# Altium project ZD-STM32-ZOUYU.PrjPcb
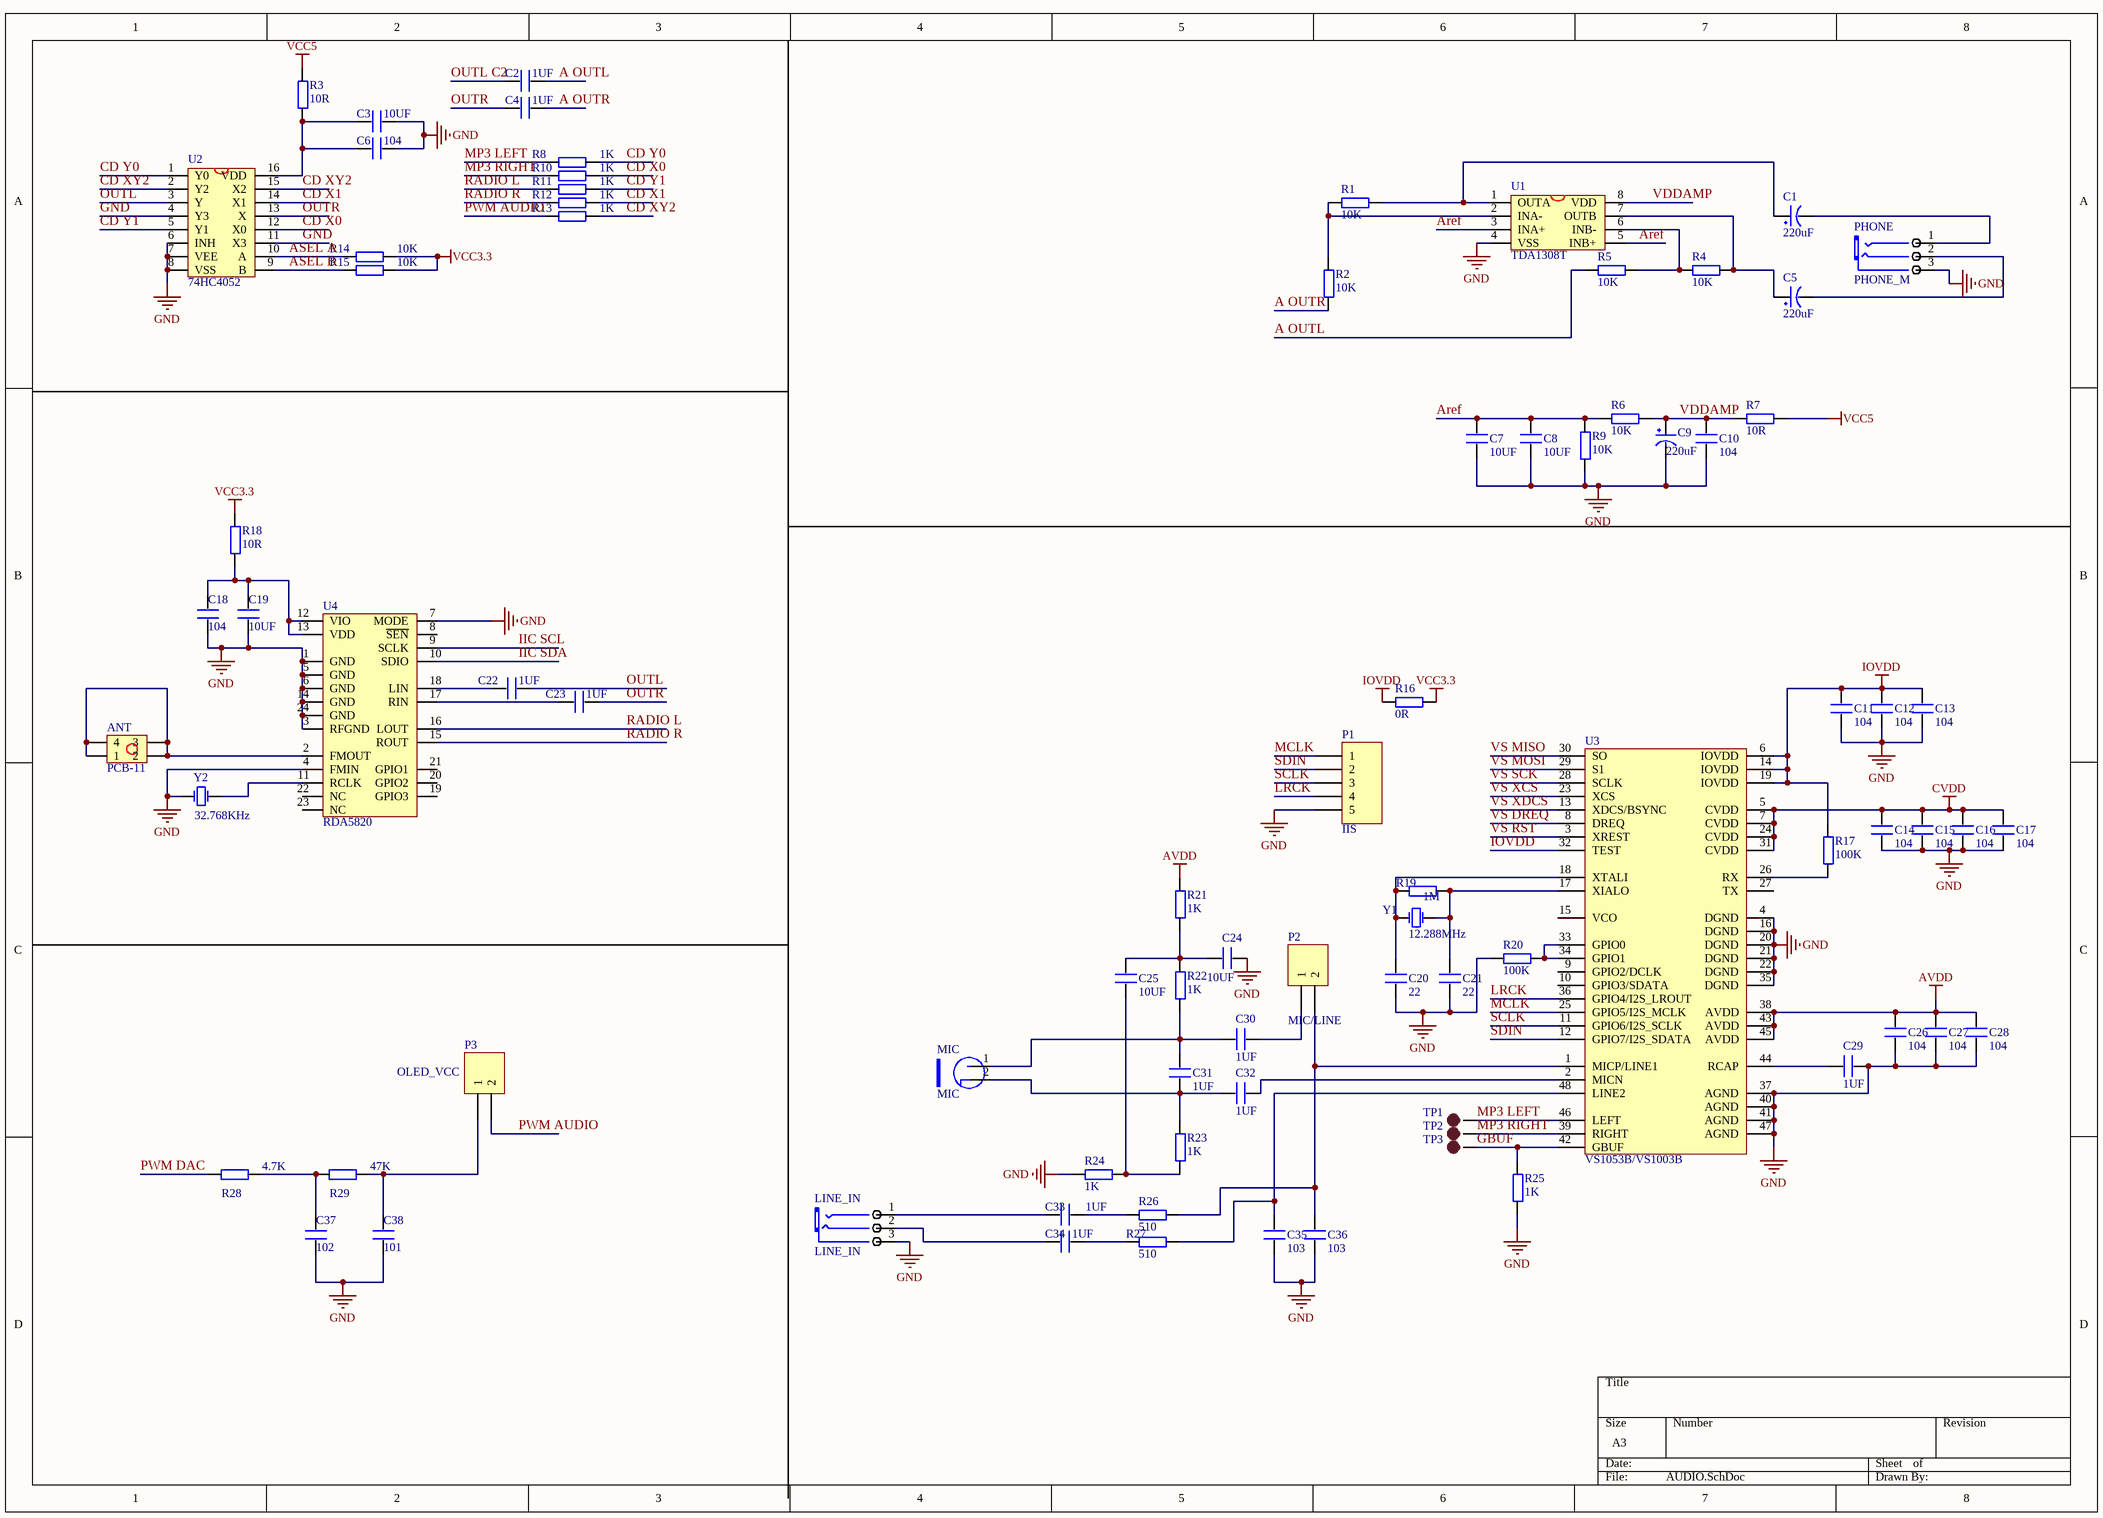
[diagram p0: AUDIO.SchDoc]
4 sheets, 254 parts. Net scope: global (net labels, ports and power ports of the same name join across sheets).
Board files: ZD-STM32-ZOUYU(remove layoout).PcbDoc, ZD-STM32-ZOUYU.PcbDoc
Sheets:
  AUDIO.SchDoc
  DEVICE.SchDoc
  ZD-STM32.SchDoc
  POWER&USB.SchDoc

## Sheet AUDIO.SchDoc
size A3

### Parts
ANT  PCB-11  [PCB-11]
C1  220uF  [CC6.56.5]
C2  1UF  [0603P]
C3  10UF  [0603P]
C4  1UF  [0603P]
C5  220uF  [CC6.56.5]
C6  104  [0603P]
C7  10UF  [0603P]
C8  10UF  [0603P]
C9  220uF  [CC6.56.5]
C10  104  [0603P]
C11  104  [0603P]
C12  104  [0603P]
C13  104  [0603P]
C14  104  [0603P]
C15  104  [0603P]
C16  104  [0603P]
C17  104  [0603P]
C18  104  [0603P]
C19  10UF  [0603P]
C20  22  [0603P]
C21  22  [0603P]
C22  1UF  [0603P]
C23  1UF  [0603P]
C24  10UF  [0603P]
C25  10UF  [0603P]
C26  104  [0603P]
C27  104  [0603P]
C28  104  [0603P]
C29  1UF  [0603P]
C30  1UF  [0603P]
C31  1UF  [0603P]
C32  1UF  [0603P]
C33  1UF  [0603P]
C34  1UF  [0603P]
C35  103  [0603P]
C36  103  [0603P]
C37  102  [0603P]
C38  101  [0603P]
LINE_IN  LINE_IN  [PHONE_ST]
MIC  MIC  [MIC]
P1  IIS  [HDR1X5]
P2  MIC/LINE  [HDR1X2]
P3  OLED_VCC  [HDR1X2]
PHONE  PHONE_M  [PHONE_ST]
R1  10K  [0603P]
R2  10K  [0603P]
R3  10R  [0603P]
R4  10K  [0603P]
R5  10K  [0603P]
R6  10K  [0603P]
R7  10R  [0603P]
R8  1K  [0603P]
R9  10K  [0603P]
R10  1K  [0603P]
R11  1K  [0603P]
R12  1K  [0603P]
R13  1K  [0603P]
R14  10K  [0603P]
R15  10K  [0603P]
R16  0R  [0603P]
R17  100K  [0603P]
R18  10R  [0603P]
R19  1M  [0603P]
R20  100K  [0603P]
R21  1K  [0603P]
R22  1K  [0603P]
R23  1K  [0603P]
R24  1K  [0603P]
R25  1K  [0603P]
R26  510  [0603P]
R27  510  [0603P]
R28  4.7K  [0603P]
R29  47K  [0603P]
TP1  TEST POINT  [TP-1.5]  (value not drawn)
TP2  TEST POINT  [TP-1.5]  (value not drawn)
TP3  TEST POINT  [TP-1.5]  (value not drawn)
U1  TDA1308T  [SOP-8]
U2  74HC4052  [SOP16M]
U3  VS1053B/VS1003B  [mTQFP48]
U4  RDA5820  [QFN24]
Y1  12.288MHz  [XTAL_US]
Y2  32.768KHz  [XTAL32]

### Nets
AVDD: C26.2 C27.2 C28.2 R21.2 U3.38(AVDD) U3.43(AVDD) U3.45(AVDD)
CVDD: C14.2 C15.2 C16.2 C17.2 U3.5(CVDD) U3.7(CVDD) U3.24(CVDD) U3.31(CVDD)
GND: C3.2 C6.2 C7.1 C8.1 C9.2(GND) C10.1 C11.1 C12.1 C13.1 C14.1 C15.1 C16.1 C17.1 C18.1 C19.1 C20.1 C21.1 C24.1 C26.1 C27.1 C28.1 C29.2 C35.1 C36.1 C37.1 C38.1 LINE_IN.3(COM) P1.5 PHONE.3(COM) R9.1 R20.1 R24.1 R25.1 U1.4(VSS) U2.4(Y3) U2.6(INH) U2.7(VEE) U2.8(VSS) U2.11(X3) U3.4(DGND) U3.16(DGND) U3.20(DGND) U3.21(DGND) U3.22(DGND) U3.35(DGND) U3.37(AGND) U3.40(AGND) U3.41(AGND) U3.47(AGND) U4.1(GND) U4.3(RFGND) U4.4(FMIN) U4.5(GND) U4.6(GND) U4.7(MODE) U4.14(GND) U4.24(GND) Y2.1(OSC1)
IOVDD: C11.2 C12.2 C13.2 R16.1 R17.2 U3.6(IOVDD) U3.14(IOVDD) U3.19(IOVDD) U3.32(TEST)
VCC3.3: R14.2 R15.2 R16.2 R18.2
VCC5: R3.2 R7.2
A OUTL: C2.2 R5.1
A OUTR: C4.2 R2.1
Aref: C7.2 C8.2 R6.1 R9.2 U1.3(INA+) U1.5(INB+)
ASEL A: R14.1 U2.10(A)
ASEL B: R15.1 U2.9(B)
CD X0: R10.2 U2.12(X0)
CD X1: R12.2 U2.14(X1)
CD XY2: R13.2 U2.2(Y2) U2.15(X2)
CD Y0: R8.2 U2.1(Y0)
CD Y1: R11.2 U2.5(Y1)
GBUF: R25.2 TP3.1 U3.42(GBUF)
IIC SCL: U4.9(SCLK)
IIC SDA: U4.10(SDIO)
LRCK: P1.4 U3.36(GPIO4/I2S_LROUT)
MCLK: P1.1 U3.25(GPIO5/I2S_MCLK)
MP3 LEFT: R8.1 TP1.1 U3.46(LEFT)
MP3 RIGHT: R10.1 TP2.1 U3.39(RIGHT)
OUTL: C22.1 U2.3(Y)
OUTL C2: C2.1
OUTR: C4.1 C23.1 U2.13(X)  [also labelled OUTR ]
PWM AUDIO: P3.2 R13.1
PWM DAC: R28.1  [project net PB6]
RADIO L: R11.1 U4.16(LOUT)
RADIO R: R12.1 U4.15(ROUT)
SCLK: P1.3 U3.11(GPIO6/I2S_SCLK)
SDIN: P1.2 U3.12(GPIO7/I2S_SDATA)
VDDAMP: C9.1(VCC) C10.2 R6.2 R7.1 U1.8(VDD)
VS DREQ: U3.8(DREQ)  [project net PC13]
VS MISO: U3.30(SO)  [project net PA6]
VS MOSI: U3.29(S1)  [project net PA7]
VS RST: U3.3(XREST)  [project net PE6]
VS SCK: U3.28(SCLK)  [project net PA5]
VS XCS: U3.23(XCS)
VS XDCS: U3.13(XDCS/BSYNC)
NetANT_1: ANT.1 ANT.2 ANT.3 ANT.4 U4.2(FMOUT)
NetC1_1: C1.1(VCC) R1.2 U1.1(OUTA)
NetC1_2: C1.2(GND) PHONE.1(CHL)
NetC3_1: C3.1 C6.1 R3.1 U2.16(VDD)
NetC5_1: C5.1(VCC) R4.2 U1.7(OUTB)
NetC5_2: C5.2(GND) PHONE.2(CHR)
NetC18_2: C18.2 C19.2 R18.1 U4.12(VIO) U4.13(VDD)
NetC20_2: C20.2 R19.1 U3.18(XTALI) Y1.1(OSC1)
NetC21_2: C21.2 R19.2 U3.17(XIALO) Y1.2(OSC2)
NetC22_2: C22.2 U4.18(LIN)
NetC23_2: C23.2 U4.17(RIN)
NetC24_2: C24.2 C25.2 R21.1 R22.2
NetC25_1: C25.1 R23.1 R24.2
NetC29_1: C29.1 U3.44(RCAP)
NetC30_1: C30.1 C31.2 MIC.1(VCC) R22.1
NetC30_2: C30.2 P2.1
NetC31_1: C31.1 C32.1 MIC.2(GND) R23.2
NetC32_2: C32.2 U3.2(MICN)
NetC33_1: C33.1 LINE_IN.1(CHL)
NetC33_2: C33.2 R26.1
NetC34_1: C34.1 LINE_IN.2(CHR)
NetC34_2: C34.2 R27.1
NetC35_2: C35.2 R27.2 U3.48(LINE2)
NetC36_2: C36.2 P2.2 R26.2 U3.1(MICP/LINE1)
NetC37_2: C37.2 R28.2 R29.1
NetC38_2: C38.2 P3.1 R29.2
NetR1_1: R1.1 R2.2 U1.2(INA-)
NetR4_1: R4.1 R5.2 U1.6(INB-)
NetR17_1: R17.1 U3.26(RX)
NetR20_2: R20.2 U3.33(GPIO0) U3.34(GPIO1)
NetU4_11: U4.11(RCLK) Y2.2(OSC2)

Not connected (* = marked no-connect by the designer): U3 9(GPIO2/DCLK) 10(GPIO3/SDATA) 15(VCO) 27(TX); U4 8(~{SEN}) 19(GPIO3) 20(GPIO2) 21(GPIO1) 22(NC) 23(NC)

### Library data of the parts
ANT = PCB-11: PCB接线端子
C1 C5 C9 = CAP
C2-C4 C6-C8 C10-C38 = C
LINE_IN = PHONE_M
P1 = Header 5: Header, 5-Pin; LatestRevisionDate: 17-Jul-2002; LatestRevisionNote: Re-released for DXP Platform.; Publisher: Altium Limited
P2 P3 = Header 2: Header, 2-Pin; LatestRevisionDate: 17-Jul-2002; LatestRevisionNote: Re-released for DXP Platform.; Publisher: Altium Limited
R1-R29 = R
TP1-TP3 = TEST-POINT: 测试点
U1 = TDA1308
U2 = CD4052
U3 = VS1053
Y1 = XTAL_2: Crystal Oscillator; Published: 8-Jun-2000; LatestRevisionDate: 17-Jul-2002; LatestRevisionNote: Re-released for DXP Platform.; Publisher: Altium Limited
Y2 = XTAL_3: 32.768K; Published: 8-Jun-2000; LatestRevisionDate: 17-Jul-2002; LatestRevisionNote: Re-released for DXP Platform.; Publisher: Altium Limited

## Sheet DEVICE.SchDoc
size A3
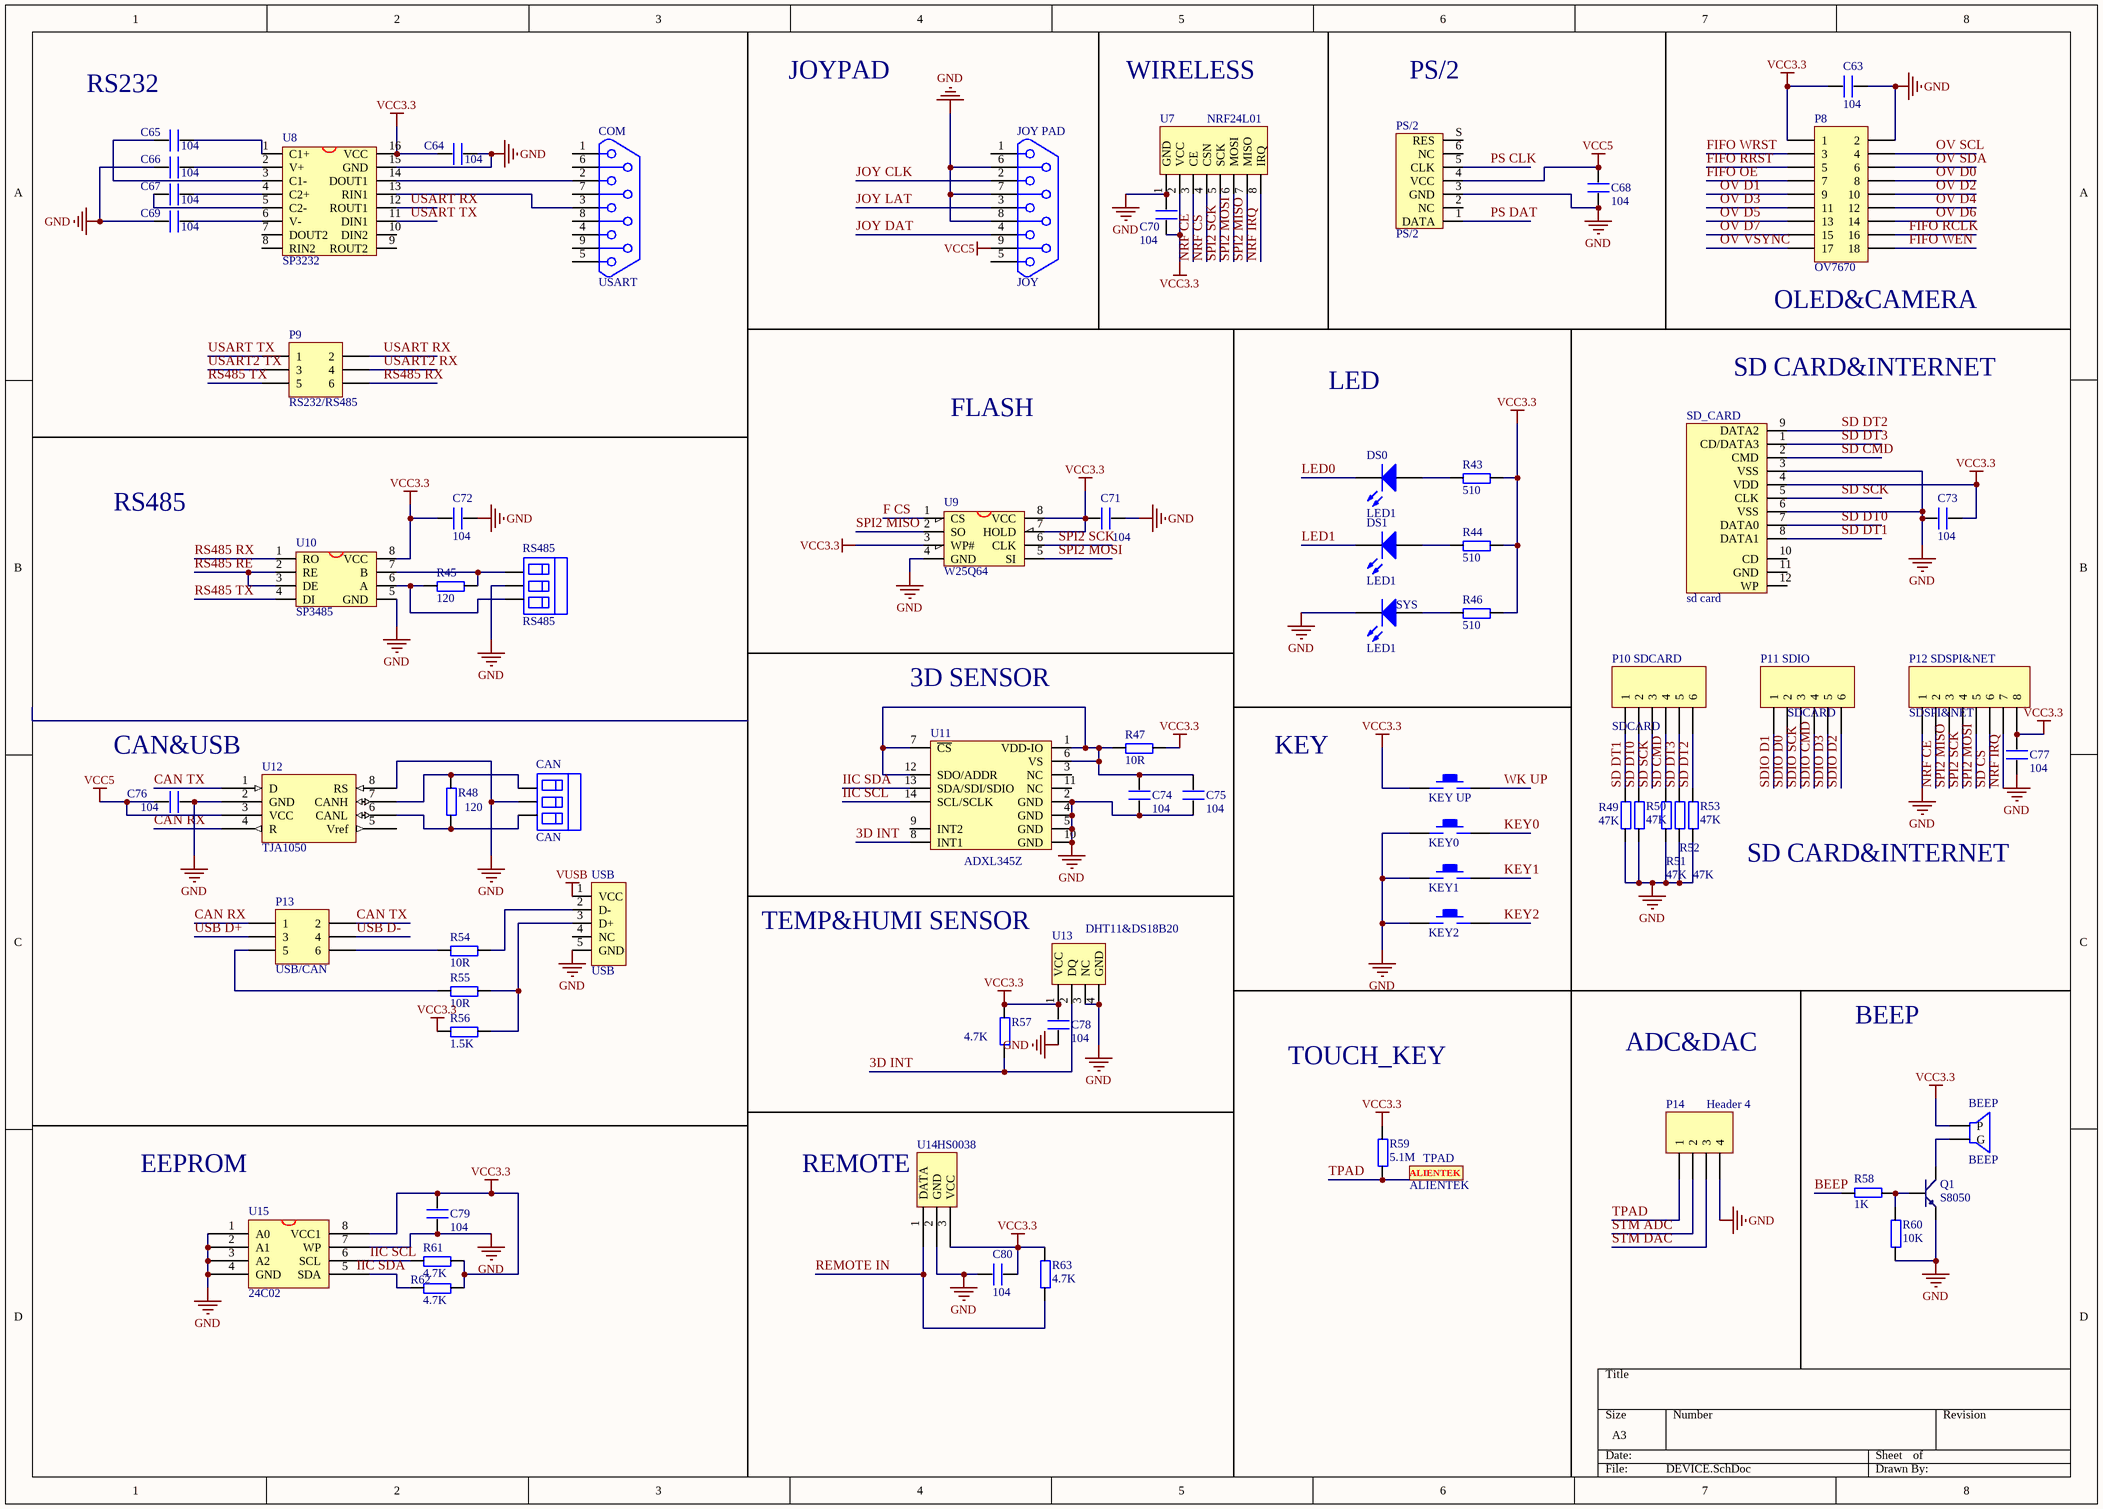
[diagram p1: DEVICE.SchDoc]

### Parts
BEEP  BEEP  [BELL-5]
C63  104  [0603P]
C64  104  [0603P]
C65  104  [0603P]
C66  104  [0603P]
C67  104  [0603P]
C68  104  [0603P]
C69  104  [0603P]
C70  104  [0603P]
C71  104  [0603P]
C72  104  [0603P]
C73  104  [0603P]
C74  104  [0603P]
C75  104  [0603P]
C76  104  [0603P]
C77  104  [0603P]
C78  104  [0603P]
C79  104  [0603P]
C80  104  [0603P]
CAN  CAN  [MKDSN_3RMI]
COM  USART  [DB9]
DS0  LED1  [SMDLED]
DS1  LED1  [SMDLED]
JOY_PAD  JOY  [DB9]
KEY0  KEY_M  [KEY_M]  (value not drawn)
KEY1  KEY_M  [KEY_M]  (value not drawn)
KEY2  KEY_M  [KEY_M]  (value not drawn)
KEY_UP  KEY_M  [KEY_M]  (value not drawn)
P8  OV7670  [HDR2X9]
P9  RS232/RS485  [HDR2X3]
P10_SDCARD  SDCARD  [HDR1X6]
P11_SDIO  SDCARD  [HDR1X6]
P12_SDSPI&NET  SDSPI&NET  [HDR1X8]
P13  USB/CAN  [HDR2X3]
P14  Header 4  [HDR1X4]
PS/2  PS/2  [PS2-6PIN]
Q1  S8050  [SOT-23R]
R43  510  [0603P]
R44  510  [0603P]
R45  120  [0603P]
R46  510  [0603P]
R47  10R  [0603P]
R48  120  [0603P]
R49  47K  [0603P]
R50  47K  [0603P]
R51  47K  [0603P]
R52  47K  [0603P]
R53  47K  [0603P]
R54  10R  [0603P]
R55  10R  [0603P]
R56  1.5K  [0603P]
R57  4.7K  [0603P]
R58  1K  [0603P]
R59  5.1M  [0603P]
R60  10K  [0603P]
R61  4.7K  [0603P]
R62  4.7K  [0603P]
R63  4.7K  [0603P]
RS485  RS485  [MKDSN_3RMI]
SD_CARD  sd card  [SDCARD_L]
SYS  LED1  [SMDLED]
TPAD  ALIENTEK  [ALIENTEK_PAD]
U7  NRF24L01  [NRF24L01]
U8  SP3232  [SOP16M]
U9  W25Q64  [SOIC-8]
U10  SP3485  [SOP-8]
U11  ADXL345Z  [LGA14]
U12  TJA1050  [SOP-8]
U13  DHT11&DS18B20  [DHT11]
U14  HS0038  [HS0038]
U15  24C02  [SOP-8]
USB  USB  [USB/SM0.8-6H5]

### Nets
GND: C63.2 C64.2 C66.1 C68.1 C69.1 C70.2 C71.2 C72.2 C73.1 C74.1 C75.1 C76.2 C77.1 C78.1 C79.1 C80.1 CAN.2 JOY_PAD.6 JOY_PAD.7 JOY_PAD.8 KEY0.1 KEY1.1 KEY2.1 P8.2 P12_SDSPI&NET.1 P14.4 PS/2.3(GND) Q1.1(E) R49.1 R50.1 R51.1 R52.1 R53.1 R60.1 RS485.2 SD_CARD.3(VSS) SD_CARD.6(VSS) SYS.2(K) U7.1(GND) U8.15(GND) U9.4(GND) U10.5(GND) U11.2(GND) U11.4(GND) U11.5(GND) U11.10(GND) U12.2(GND) U12.8(RS) U13.3(NC) U13.4(GND) U14.2(GND) U15.1(A0) U15.2(A1) U15.3(A2) U15.4(GND) U15.7(WP) USB.5(GND)
VCC3.3: BEEP.1(P) C63.1 C64.1 C70.1 C71.1 C72.1 C73.2 C77.2 C78.2 C79.2 C80.2 KEY_UP.1 P8.1 P12_SDSPI&NET.8 R43.2 R44.2 R46.2 R47.2 R56.1 R57.2 R59.2 R61.2 R62.2 R63.2 SD_CARD.4(VDD) U7.2(VCC) U8.16(VCC) U9.3(WP#) U9.7(HOLD) U9.8(VCC) U10.8(VCC) U13.1(VCC) U14.3(VCC) U15.8(VCC1)
VCC5: C68.2 C76.1 JOY_PAD.9 PS/2.4(VCC) U12.3(VCC)
VUSB: USB.1(VCC)
3D INT: R57.1 U11.8(INT1) U13.2(DQ)
BEEP: R58.2
CAN RX: P13.1 U12.4(R)
CAN TX: P13.2 U12.1(D)
F CS: U9.1(CS)
FIFO OE: P8.7
FIFO RCLK: P8.16
FIFO RRST: P8.5
FIFO WEN: P8.18
FIFO WRST: P8.3
IIC SCL: R61.1 U11.14(SCL/SCLK) U15.6(SCL)
IIC SDA: U11.13(SDA/SDI/SDIO)
JOY CLK: JOY_PAD.2 P11_SDIO.3  [also labelled SDIO SCK]
JOY DAT: JOY_PAD.4 P11_SDIO.1  [also labelled SDIO D1]
JOY LAT: JOY_PAD.3 P11_SDIO.2  [also labelled SDIO D0]
KEY0: KEY0.2
KEY1: KEY1.2
KEY2: KEY2.2
LED0: DS0.2(K)
LED1: DS1.2(K)
NRF CE: P12_SDSPI&NET.2 U7.3(CE)
NRF CS: U7.4(CSN)
NRF IRQ: P12_SDSPI&NET.7 U7.8(IRQ)
OV D0: P8.8
OV D1: P8.9
OV D2: P8.10
OV D3: P8.11
OV D4: P8.12
OV D5: P8.13
OV D6: P8.14
OV D7: P8.15
OV SCL: P8.4
OV SDA: P8.6
OV VSYNC: P8.17
PS CLK: P11_SDIO.5 PS/2.5(CLK)  [also labelled SDIO D3]  [project net PC11]
PS DAT: P11_SDIO.6 PS/2.1(DATA)  [also labelled SDIO D2]  [project net PC10]
REMOTE IN: R63.1 U14.1(DATA)  [project net PB9]
RS485 RE: U10.2(RE) U10.3(DE)  [project net PG9]
RS485 RX: P9.6 U10.1(RO)
RS485 TX: P9.5 U10.4(DI)
SD CMD: P10_SDCARD.4 R51.2 SD_CARD.2(CMD)
SD CS: P11_SDIO.4 P12_SDSPI&NET.6  [also labelled SDIO CMD]  [project net PD2]
SD DT0: P10_SDCARD.2 R50.2 SD_CARD.7(DATA0)
SD DT1: P10_SDCARD.1 R49.2 SD_CARD.8(DATA1)
SD DT2: P10_SDCARD.6 R53.2 SD_CARD.9(DATA2)
SD DT3: P10_SDCARD.5 R52.2 SD_CARD.1(CD/DATA3)
SD SCK: P10_SDCARD.3 SD_CARD.5(CLK)
SPI2 MISO: P12_SDSPI&NET.3 U7.7(MISO) U9.2(SO)  [project net PB14]
SPI2 MOSI: P12_SDSPI&NET.5 U7.6(MOSI) U9.5(SI)  [project net PB15]
SPI2 SCK: P12_SDSPI&NET.4 U7.5(SCK) U9.6(CLK)  [project net PB13]
STM ADC: P14.2  [project net PA1]
STM DAC: P14.3  [project net PA4]
TPAD: P14.1 R59.1
USART2 RX: P9.4  [project net PA3]
USART2 TX: P9.3  [project net PA2]
USART RX: P9.2 U8.12(ROUT1)
USART TX: P9.1 U8.11(DIN1)
USB D+: P13.3  [project net PA12]
USB D-: P13.4  [project net PA11]
WK UP: KEY_UP.2  [project net PA0]
NetBEEP_2: BEEP.2(G) Q1.3(C)
NetC65_1: C65.1 U8.3(C1-)
NetC65_2: C65.2 U8.1(C1+)
NetC66_2: C66.2 U8.2(V+)
NetC67_1: C67.1 U8.5(C2-)
NetC67_2: C67.2 U8.4(C2+)
NetC69_2: C69.2 U8.6(V-)
NetC74_2: C74.2 C75.2 R47.1 U11.1(VDD-IO) U11.6(VS) U11.7(~{CS}) U11.12(SDO/ADDR)
NetCAN_1: CAN.1 R48.2 U12.7(CANH)
NetCAN_3: CAN.3 R48.1 U12.6(CANL)
NetCOM_2: COM.2 U8.14(DOUT1)
NetCOM_3: COM.3 U8.13(RIN1)
NetDS0_1: DS0.1(A) R43.1
NetDS1_1: DS1.1(A) R44.1
NetP13_5: P13.5 R55.1
NetP13_6: P13.6 R54.1
NetQ1_2: Q1.2(B) R58.1 R60.2
NetR45_1: R45.1 RS485.3 U10.6(A)
NetR45_2: R45.2 RS485.1 U10.7(B)
NetR46_1: R46.1 SYS.1(A)
NetR54_2: R54.2 USB.2(D-)
NetR55_2: R55.2 R56.2 USB.3(D+)
NetR62_1: R62.1 U15.5(SDA)

Not connected (* = marked no-connect by the designer): COM 1 4 5 6 7 8 9; JOY_PAD 1 5; PS/2 2(NC) 6(NC) S(RES); SD_CARD 10(CD) 11(GND) 12(WP); U8 7(DOUT2) 8(RIN2) 9(ROUT2) 10(DIN2); U11 3(NC) 9(INT2) 11(NC); U12 5(Vref); USB 4(NC)

### Notes on the sheet
- (near C65) RS232
- JOYPAD
- WIRELESS
- PS/2
- (near P8) OLED&CAMERA
- (near SD_CARD) SD CARD&INTERNET
- FLASH
- LED
- RS485
- 3D SENSOR
- CAN&USB
- KEY
- SD CARD&INTERNET
- TEMP&HUMI SENSOR
- ADC&DAC
- BEEP
- TOUCH_KEY
- EEPROM
- (near U14) REMOTE
- Labels drawn without touching a wire or pin: IIC SDA

### Library data of the parts
C63-C80 = C
CAN RS485 = HEAD3
COM JOY_PAD = DB9
DS0 DS1 SYS = LED2: Typical RED, GREEN, YELLOW, AMBER GaAs LED; Published: 8-Jun-2000; LatestRevisionDate: 17-Jul-2002; LatestRevisionNote: Re-released for DXP Platform.; PackageDocument: Feb-2002; PackageReference: 3.2X1.6X1.1; Publisher: Altium Limited
P8 = Header 9X2: Header, 9-Pin, Dual row; LatestRevisionDate: 17-Jul-2002; LatestRevisionNote: Re-released for DXP Platform.; Publisher: Altium Limited
P9 P13 = Header 3X2: Header, 3-Pin, Dual row; LatestRevisionDate: 17-Jul-2002; LatestRevisionNote: Re-released for DXP Platform.; Publisher: Altium Limited
P10_SDCARD P11_SDIO = Header 6: Header, 6-Pin; LatestRevisionDate: 17-Jul-2002; LatestRevisionNote: Re-released for DXP Platform.; Publisher: Altium Limited
P12_SDSPI&NET = Header 8: Header, 8-Pin; LatestRevisionDate: 17-Jul-2002; LatestRevisionNote: Re-released for DXP Platform.; Publisher: Altium Limited
P14 = Header 4: Header, 4-Pin; LatestRevisionDate: 17-Jul-2002; LatestRevisionNote: Re-released for DXP Platform.; Publisher: Altium Limited
PS/2 = P/S2
Q1 = NPN: 8050/BCW846/BCW847
R43-R63 = R
U8 = MAX3232
U9 = W25X16: W25X16;SST25VF016;MX25L1605
U10 = MAX3485
U12 = SN65HVD230D
U13 = DHT11: 数字温湿度传感器
U15 = 24C256
USB = USB5

## Sheet ZD-STM32.SchDoc
size A3
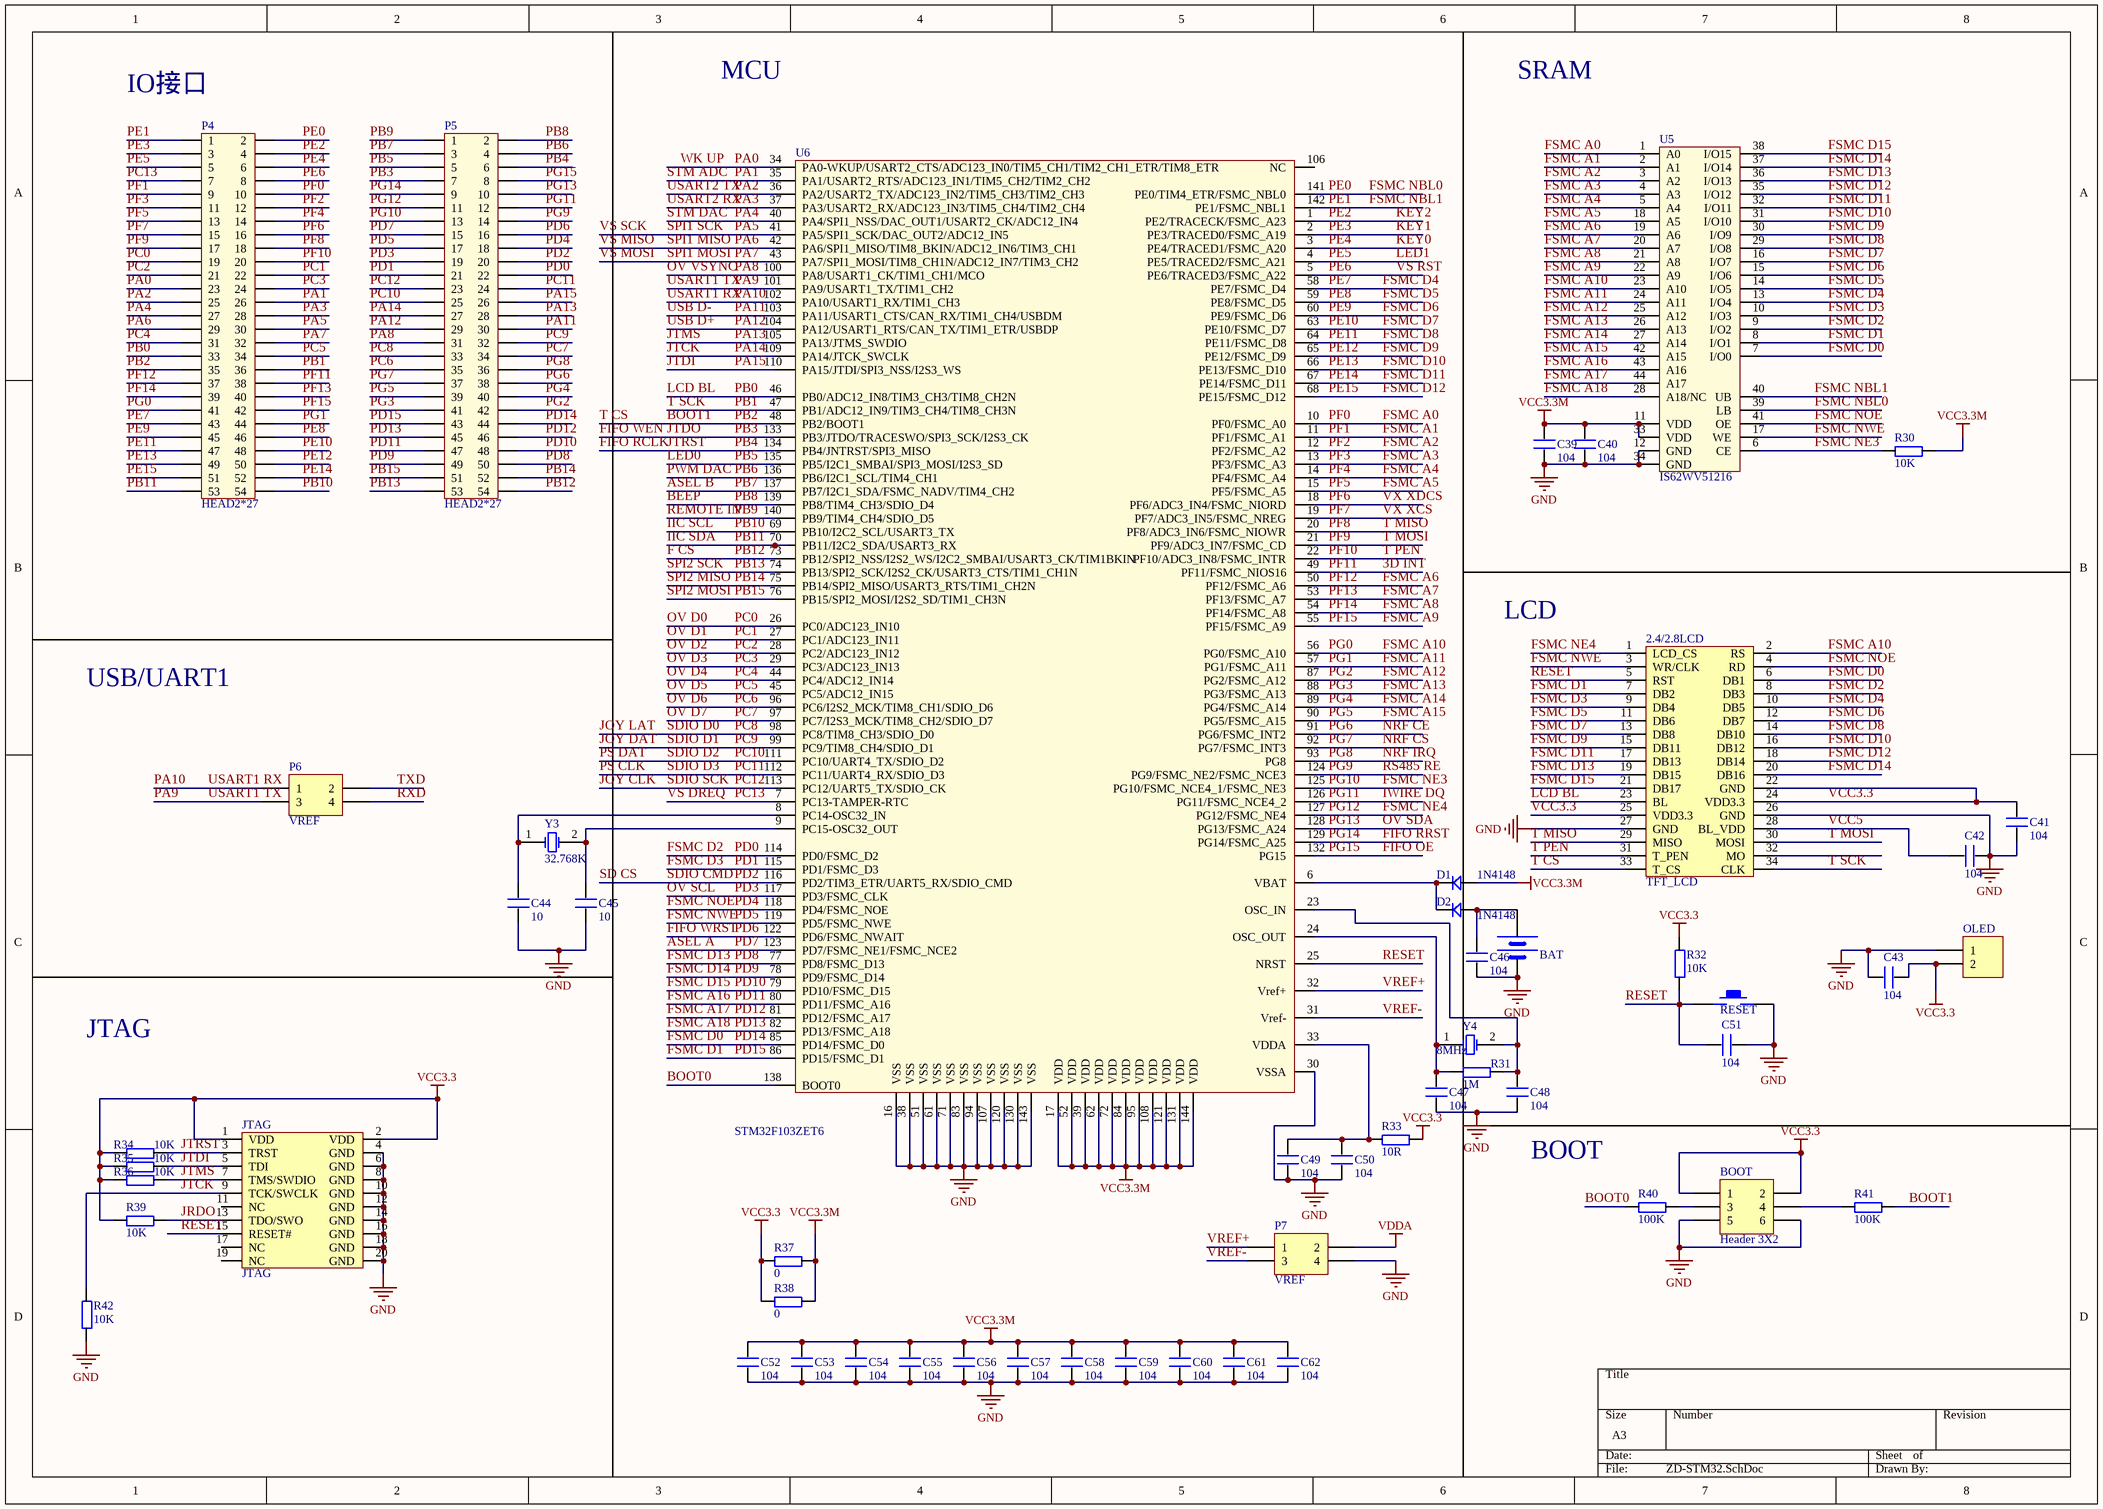
[diagram p2: ZD-STM32.SchDoc]

### Parts
2.4/2.8LCD  TFT_LCD  [DB2*17]
BAT  BATT  [BATM]  (value not drawn)
BOOT  Header 3X2  [HDR2X3]
C39  104  [0603P]
C40  104  [0603P]
C41  104  [0603P]
C42  104  [0603P]
C43  104  [0603P]
C44  10  [0603P]
C45  10  [0603P]
C46  104  [0603P]
C47  104  [0603P]
C48  104  [0603P]
C49  104  [0603P]
C50  104  [0603P]
C51  104  [0603P]
C52  104  [0603P]
C53  104  [0603P]
C54  104  [0603P]
C55  104  [0603P]
C56  104  [0603P]
C57  104  [0603P]
C58  104  [0603P]
C59  104  [0603P]
C60  104  [0603P]
C61  104  [0603P]
C62  104  [0603P]
D1  1N4148  [DIODE_SOP]
D2  1N4148  [DIODE_SOP]
JTAG  JTAG  [JTAG_20]
OLED  MIC/LINE  [HDR1X2]  (value not drawn)
P4  HEAD2*27  [HEAD2*27]
P5  HEAD2*27  [HEAD2*27]
P6  VREF  [HDR2X2]
P7  VREF  [HDR2X2]
R30  10K  [0603P]
R31  1M  [0603P]
R32  10K  [0603P]
R33  10R  [0603P]
R34  10K  [0603P]
R35  10K  [0603P]
R36  10K  [0603P]
R37  0  [0603P]
R38  0  [0603P]
R39  10K  [0603P]
R40  100K  [0603P]
R41  100K  [0603P]
R42  10K  [0603P]
RESET  KEY_M  [KEY_M]  (value not drawn)
U5  IS62WV51216  [TSOP44]
U6  STM32F103ZET6  [LQFP144]
Y3  32.768K  [XTAL32]
Y4  8MHz  [XTAL_US]

### Nets
GND: 2.4/2.8LCD.26(GND) 2.4/2.8LCD.27(GND) BAT.2(GND) BOOT.5 BOOT.6 C39.1 C40.1 C41.1 C42.1 C43.2 C44.1 C45.1 C46.1 C47.1 C48.1 C49.1 C50.1 C51.1 C52.2 C53.2 C54.2 C55.2 C56.2 C57.2 C58.2 C59.2 C60.2 C61.2 C62.2 JTAG.4(GND) JTAG.6(GND) JTAG.8(GND) JTAG.10(GND) JTAG.12(GND) JTAG.14(GND) JTAG.16(GND) JTAG.18(GND) JTAG.20(GND) OLED.1 P7.4 R42.1 RESET.2 U5.12(GND) U5.34(GND) U6.16(VSS) U6.30(VSSA) U6.38(VSS) U6.51(VSS) U6.61(VSS) U6.71(VSS) U6.83(VSS) U6.94(VSS) U6.107(VSS) U6.120(VSS) U6.130(VSS) U6.143(VSS)
VCC3.3: 2.4/2.8LCD.22(GND) 2.4/2.8LCD.24(VDD3.3) 2.4/2.8LCD.25(VDD3.3) BOOT.1 BOOT.2 C41.2 C43.1 JTAG.1(VDD) JTAG.2(VDD) OLED.2 R32.2 R33.2 R34.1 R35.1 R36.1 R37.1 R38.1 R39.1
VCC3.3M: C39.2 C40.2 C52.1 C53.1 C54.1 C55.1 C56.1 C57.1 C58.1 C59.1 C60.1 C61.1 C62.1 D1.1 R30.2 R37.2 R38.2 U5.11(VDD) U5.33(VDD) U6.17(VDD) U6.39(VDD) U6.52(VDD) U6.62(VDD) U6.72(VDD) U6.84(VDD) U6.95(VDD) U6.108(VDD) U6.121(VDD) U6.131(VDD) U6.144(VDD)
VCC5: 2.4/2.8LCD.28(BL_VDD) C42.2
VDDA: P7.2
3D INT: P4.38 U6.49(PF11/FSMC_NIOS16)  [also labelled PF11]
ASEL A: P5.15 U6.123(PD7/FSMC_NE1/FSMC_NCE2)  [also labelled PD7]
ASEL B: P5.3 U6.137(PB7/I2C1_SDA/FSMC_NADV/TIM4_CH2)  [also labelled PB7]
BEEP: P5.2 U6.139(PB8/TIM4_CH3/SDIO_D4)  [also labelled PB8]
BOOT0: R40.1 U6.138(BOOT0)
BOOT1: 2.4/2.8LCD.33(T_CS) P4.35 R41.2 U6.48(PB2/BOOT1)  [also labelled PB2, T CS]
F CS: P5.54 U6.73(PB12/SPI2_NSS/I2S2_WS/I2C2_SMBAI/USART3_CK/TIM1BKIN)  [also labelled PB12]
FIFO OE: P5.8 U6.132(PG15)  [also labelled PG15]
FIFO RCLK: JTAG.3(TRST) P5.6 R34.2 U6.134(PB4/JNTRST/SPI3_MISO)  [also labelled JTRST, PB4]
FIFO RRST: P5.9 U6.129(PG14/FSMC_A25)  [also labelled PG14]
FIFO WEN: P5.7 U6.133(PB3/JTDO/TRACESWO/SPI3_SCK/I2S3_CK)  [also labelled JTDO, PB3]
FIFO WRST: P5.16 U6.122(PD6/FSMC_NWAIT)  [also labelled PD6]
FSMC A0: P4.10 U5.1(A0) U6.10(PF0/FSMC_A0)  [also labelled PF0]
FSMC A1: P4.9 U5.2(A1) U6.11(PF1/FSMC_A1)  [also labelled PF1]
FSMC A2: P4.12 U5.3(A2) U6.12(PF2/FSMC_A2)  [also labelled PF2]
FSMC A3: P4.11 U5.4(A3) U6.13(PF3/FSMC_A3)  [also labelled PF3]
FSMC A4: P4.14 U5.5(A4) U6.14(PF4/FSMC_A4)  [also labelled PF4]
FSMC A5: P4.13 U5.18(A5) U6.15(PF5/FSMC_A5)  [also labelled PF5]
FSMC A6: P4.37 U5.19(A6) U6.50(PF12/FSMC_A6)  [also labelled PF12]
FSMC A7: P4.40 U5.20(A7) U6.53(PF13/FSMC_A7)  [also labelled PF13]
FSMC A8: P4.39 U5.21(A8) U6.54(PF14/FSMC_A8)  [also labelled PF14]
FSMC A9: P4.42 U5.22(A9) U6.55(PF15/FSMC_A9)  [also labelled PF15]
FSMC A10: 2.4/2.8LCD.2(RS) P4.41 U5.23(A10) U6.56(PG0/FSMC_A10)  [also labelled PG0]
FSMC A11: P4.44 U5.24(A11) U6.57(PG1/FSMC_A11)  [also labelled PG1]
FSMC A12: P5.42 U5.25(A12) U6.87(PG2/FSMC_A12)  [also labelled PG2]
FSMC A13: P5.41 U5.26(A13) U6.88(PG3/FSMC_A13)  [also labelled PG3]
FSMC A14: P5.40 U5.27(A14) U6.89(PG4/FSMC_A14)  [also labelled PG4]
FSMC A15: P5.39 U5.42(A15) U6.90(PG5/FSMC_A15)  [also labelled PG5]
FSMC A16: P5.47 U5.43(A16) U6.80(PD11/FSMC_A16)  [also labelled PD11]
FSMC A17: P5.46 U5.44(A17) U6.81(PD12/FSMC_A17)  [also labelled PD12]
FSMC A18: P5.45 U5.28(A18/NC) U6.82(PD13/FSMC_A18)  [also labelled PD13]
FSMC D0: 2.4/2.8LCD.6(DB1) P5.44 U5.7(I/O0) U6.85(PD14/FSMC_D0)  [also labelled PD14]
FSMC D1: 2.4/2.8LCD.7(DB2) P5.43 U5.8(I/O1) U6.86(PD15/FSMC_D1)  [also labelled PD15]
FSMC D2: 2.4/2.8LCD.8(DB3) P5.22 U5.9(I/O2) U6.114(PD0/FSMC_D2)  [also labelled PD0]
FSMC D3: 2.4/2.8LCD.9(DB4) P5.21 U5.10(I/O3) U6.115(PD1/FSMC_D3)  [also labelled PD1]
FSMC D4: 2.4/2.8LCD.10(DB5) P4.43 U5.13(I/O4) U6.58(PE7/FSMC_D4)  [also labelled PE7]
FSMC D5: 2.4/2.8LCD.11(DB6) P4.46 U5.14(I/O5) U6.59(PE8/FSMC_D5)  [also labelled PE8]
FSMC D6: 2.4/2.8LCD.12(DB7) P4.45 U5.15(I/O6) U6.60(PE9/FSMC_D6)  [also labelled PE9]
FSMC D7: 2.4/2.8LCD.13(DB8) P4.48 U5.16(I/O7) U6.63(PE10/FSMC_D7)  [also labelled PE10]
FSMC D8: 2.4/2.8LCD.14(DB10) P4.47 U5.29(I/O8) U6.64(PE11/FSMC_D8)  [also labelled PE11]
FSMC D9: 2.4/2.8LCD.15(DB11) P4.50 U5.30(I/O9) U6.65(PE12/FSMC_D9)  [also labelled PE12]
FSMC D10: 2.4/2.8LCD.16(DB12) P4.49 U5.31(I/O10) U6.66(PE13/FSMC_D10)  [also labelled PE13]
FSMC D11: 2.4/2.8LCD.17(DB13) P4.52 U5.32(I/O11) U6.67(PE14/FSMC_D11)  [also labelled PE14]
FSMC D12: 2.4/2.8LCD.18(DB14) P4.51 U5.35(I/O12) U6.68(PE15/FSMC_D12)  [also labelled PE15]
FSMC D13: 2.4/2.8LCD.19(DB15) P5.50 U5.36(I/O13) U6.77(PD8/FSMC_D13)  [also labelled PD8]
FSMC D14: 2.4/2.8LCD.20(DB16) P5.49 U5.37(I/O14) U6.78(PD9/FSMC_D14)  [also labelled PD9]
FSMC D15: 2.4/2.8LCD.21(DB17) P5.48 U5.38(I/O15) U6.79(PD10/FSMC_D15)  [also labelled PD10]
FSMC NBL0: P4.2 U5.39(LB) U6.141(PE0/TIM4_ETR/FSMC_NBL0)  [also labelled PE0]
FSMC NBL1: P4.1 U5.40(UB) U6.142(PE1/FSMC_NBL1)  [also labelled PE1]
FSMC NE3: P5.13 R30.1 U5.6(CE) U6.125(PG10/FSMC_NCE4_1/FSMC_NE3)  [also labelled PG10]
FSMC NE4: 2.4/2.8LCD.1(LCD_CS) P5.11 U6.127(PG12/FSMC_NE4)  [also labelled PG12]
FSMC NOE: 2.4/2.8LCD.4(RD) P5.18 U5.41(OE) U6.118(PD4/FSMC_NOE)  [also labelled PD4]
FSMC NWE: 2.4/2.8LCD.3(WR/CLK) P5.17 U5.17(WE) U6.119(PD5/FSMC_NWE)  [also labelled PD5]
IIC SCL: P4.54 U6.69(PB10/I2C2_SCL/USART3_TX)  [also labelled PB10]
IIC SDA: P4.53 U6.70(PB11/I2C2_SDA/USART3_RX)  [also labelled PB11]
IWIRE DQ: P5.12 U6.126(PG11/FSMC_NCE4_2)  [also labelled PG11]
JOY CLK: P5.23 U6.113(PC12/UART5_TX/SDIO_CK)  [also labelled PC12, SDIO SCK]
JOY DAT: P5.32 U6.99(PC9/TIM8_CH4/SDIO_D1)  [also labelled PC9, SDIO D1]
JOY LAT: P5.33 U6.98(PC8/TIM8_CH3/SDIO_D0)  [also labelled PC8, SDIO D0]
JRDO: JTAG.13(TDO/SWO) R39.2
JTCK: JTAG.9(TCK/SWCLK) P5.27 R42.2 U6.109(PA14/JTCK_SWCLK)  [also labelled PA14]
JTDI: JTAG.5(TDI) P5.26 R35.2 U6.110(PA15/JTDI/SPI3_NSS/I2S3_WS)  [also labelled PA15]
JTMS: JTAG.7(TMS/SWDIO) P5.28 R36.2 U6.105(PA13/JTMS_SWDIO)  [also labelled PA13]
KEY0: P4.6 U6.3(PE4/TRACED1/FSMC_A20)  [also labelled PE4]
KEY1: P4.3 U6.2(PE3/TRACED0/FSMC_A19)  [also labelled PE3]
KEY2: P4.4 U6.1(PE2/TRACECK/FSMC_A23)  [also labelled PE2]
LCD BL: 2.4/2.8LCD.23(BL) P4.33 U6.46(PB0/ADC12_IN8/TIM3_CH3/TIM8_CH2N)  [also labelled PB0]
LED0: P5.5 U6.135(PB5/I2C1_SMBAI/SPI3_MOSI/I2S3_SD)  [also labelled PB5]
LED1: P4.5 U6.4(PE5/TRACED2/FSMC_A21)  [also labelled PE5]
NRF CE: P5.38 U6.91(PG6/FSMC_INT2)  [also labelled PG6]
NRF CS: P5.37 U6.92(PG7/FSMC_INT3)  [also labelled PG7]
NRF IRQ: P5.36 U6.93(PG8)  [also labelled PG8]
OV D0: P4.19 U6.26(PC0/ADC123_IN10)  [also labelled PC0]
OV D1: P4.22 U6.27(PC1/ADC123_IN11)  [also labelled PC1]
OV D2: P4.21 U6.28(PC2/ADC123_IN12)  [also labelled PC2]
OV D3: P4.24 U6.29(PC3/ADC123_IN13)  [also labelled PC3]
OV D4: P4.31 U6.44(PC4/ADC12_IN14)  [also labelled PC4]
OV D5: P4.34 U6.45(PC5/ADC12_IN15)  [also labelled PC5]
OV D6: P5.35 U6.96(PC6/I2S2_MCK/TIM8_CH1/SDIO_D6)  [also labelled PC6]
OV D7: P5.34 U6.97(PC7/I2S3_MCK/TIM8_CH2/SDIO_D7)  [also labelled PC7]
OV SCL: P5.19 U6.117(PD3/FSMC_CLK)  [also labelled PD3]
OV SDA: P5.10 U6.128(PG13/FSMC_A24)  [also labelled PG13]
OV VSYNC: P5.31 U6.100(PA8/USART1_CK/TIM1_CH1/MCO)  [also labelled PA8]
PA0: P4.23 U6.34(PA0-WKUP/USART2_CTS/ADC123_IN0/TIM5_CH1/TIM2_CH1_ETR/TIM8_ETR)  [also labelled WK UP]
PA1: P4.26 U6.35(PA1/USART2_RTS/ADC123_IN1/TIM5_CH2/TIM2_CH2)  [also labelled STM ADC]
PA2: P4.25 U6.36(PA2/USART2_TX/ADC123_IN2/TIM5_CH3/TIM2_CH3)  [also labelled USART2 TX]
PA3: P4.28 U6.37(PA3/USART2_RX/ADC123_IN3/TIM5_CH4/TIM2_CH4)  [also labelled USART2 RX]
PA4: P4.27 U6.40(PA4/SPI1_NSS/DAC_OUT1/USART2_CK/ADC12_IN4)  [also labelled STM DAC]
PA5: P4.30 U6.41(PA5/SPI1_SCK/DAC_OUT2/ADC12_IN5)  [also labelled SPI1 SCK, VS SCK]
PA6: P4.29 U6.42(PA6/SPI1_MISO/TIM8_BKIN/ADC12_IN6/TIM3_CH1)  [also labelled SPI1 MISO, VS MISO]
PA7: P4.32 U6.43(PA7/SPI1_MOSI/TIM8_CH1N/ADC12_IN7/TIM3_CH2)  [also labelled SPI1 MOSI, VS MOSI]
PA9: P6.3 U6.101(PA9/USART1_TX/TIM1_CH2)  [also labelled USART1 TX]
PA10: P6.1 U6.102(PA10/USART1_RX/TIM1_CH3)  [also labelled USART1 RX]
PA11: P5.30 U6.103(PA11/USART1_CTS/CAN_RX/TIM1_CH4/USBDM)  [also labelled USB D-]
PA12: P5.29 U6.104(PA12/USART1_RTS/CAN_TX/TIM1_ETR/USBDP)  [also labelled USB D+]
PB1: 2.4/2.8LCD.34(CLK) P4.36 U6.47(PB1/ADC12_IN9/TIM3_CH4/TIM8_CH3N)  [also labelled T SCK]
PB6: P5.4 U6.136(PB6/I2C1_SCL/TIM4_CH1)  [also labelled PWM DAC]
PB9: P5.1 U6.140(PB9/TIM4_CH4/SDIO_D5)  [also labelled REMOTE IN]
PB13: P5.53 U6.74(PB13/SPI2_SCK/I2S2_CK/USART3_CTS/TIM1_CH1N)  [also labelled SPI2 SCK]
PB14: P5.52 U6.75(PB14/SPI2_MISO/USART3_RTS/TIM1_CH2N)  [also labelled SPI2 MISO]
PB15: P5.51 U6.76(PB15/SPI2_MOSI/I2S2_SD/TIM1_CH3N)  [also labelled SPI2 MOSI]
PC10: P5.25 U6.111(PC10/UART4_TX/SDIO_D2)  [also labelled PS DAT, SDIO D2]
PC11: P5.24 U6.112(PC11/UART4_RX/SDIO_D3)  [also labelled PS CLK, SDIO D3]
PC13: P4.7 U6.7(PC13-TAMPER-RTC)  [also labelled VS DREQ]
PD2: P5.20 U6.116(PD2/TIM3_ETR/UART5_RX/SDIO_CMD)  [also labelled SD CS, SDIO CMD]
PE6: P4.8 U6.5(PE6/TRACED3/FSMC_A22)  [also labelled VS RST]
PF6: P4.16 U6.18(PF6/ADC3_IN4/FSMC_NIORD)  [also labelled VX XDCS]
PF7: P4.15 U6.19(PF7/ADC3_IN5/FSMC_NREG)  [also labelled VX XCS]
PF8: 2.4/2.8LCD.29(MISO) P4.18 U6.20(PF8/ADC3_IN6/FSMC_NIOWR)  [also labelled T MISO]
PF9: 2.4/2.8LCD.30(MOSI) P4.17 U6.21(PF9/ADC3_IN7/FSMC_CD)  [also labelled T MOSI]
PF10: 2.4/2.8LCD.31(T_PEN) P4.20 U6.22(PF10/ADC3_IN8/FSMC_INTR)  [also labelled T PEN]
PG9: P5.14 U6.124(PG9/FSMC_NE2/FSMC_NCE3)  [also labelled RS485 RE]
RESET: 2.4/2.8LCD.5(RST) C51.2 JTAG.15(RESET#) R32.1 RESET.1 U6.25(NRST)
RXD: P6.4
TXD: P6.2
VREF+: P7.1 U6.32(Vref+)
VREF-: P7.3 U6.31(Vref-)
NetBAT_1: BAT.1(VCC) C46.2 D2.1
NetBOOT_3: BOOT.3 R40.2
NetBOOT_4: BOOT.4 R41.1
NetC44_2: C44.2 U6.8(PC14-OSC32_IN) Y3.1(OSC1)
NetC45_2: C45.2 U6.9(PC15-OSC32_OUT) Y3.2(OSC2)
NetC47_2: C47.2 R31.1 U6.24(OSC_OUT) Y4.1(OSC1)
NetC48_2: C48.2 R31.2 U6.23(OSC_IN) Y4.2(OSC2)
NetC49_2: C49.2 C50.2 R33.1 U6.33(VDDA)
NetD1_2: D1.2 D2.2 U6.6(VBAT)

Not connected (* = marked no-connect by the designer): 2.4/2.8LCD 32(MO); JTAG 11(NC) 17(NC) 19(NC); U6 106(NC)

### Notes on the sheet
- (near P4) IO接口
- MCU
- SRAM
- LCD
- USB/UART1
- JTAG
- (near C48) BOOT

### Library data of the parts
BAT = BAT
BOOT = Header 3X2: Header, 3-Pin, Dual row; LatestRevisionDate: 17-Jul-2002; LatestRevisionNote: Re-released for DXP Platform.; Publisher: Altium Limited
C39-C62 = C
D1 D2 = D
OLED = Header 2_1: Header, 2-Pin; LatestRevisionDate: 17-Jul-2002; LatestRevisionNote: Re-released for DXP Platform.; Publisher: Altium Limited
P6 P7 = Header 2X2: Header, 2-Pin, Dual row; LatestRevisionDate: 17-Jul-2002; LatestRevisionNote: Re-released for DXP Platform.; Publisher: Altium Limited
R30-R42 = R
U5 = IS61LV51216
Y3 = XTAL_1: Crystal Oscillator; Published: 8-Jun-2000; LatestRevisionDate: 17-Jul-2002; LatestRevisionNote: Re-released for DXP Platform.; Publisher: Altium Limited
Y4 = XTAL: Crystal Oscillator; Published: 8-Jun-2000; LatestRevisionDate: 17-Jul-2002; LatestRevisionNote: Re-released for DXP Platform.; Publisher: Altium Limited

## Sheet POWER&USB.SchDoc
size A3
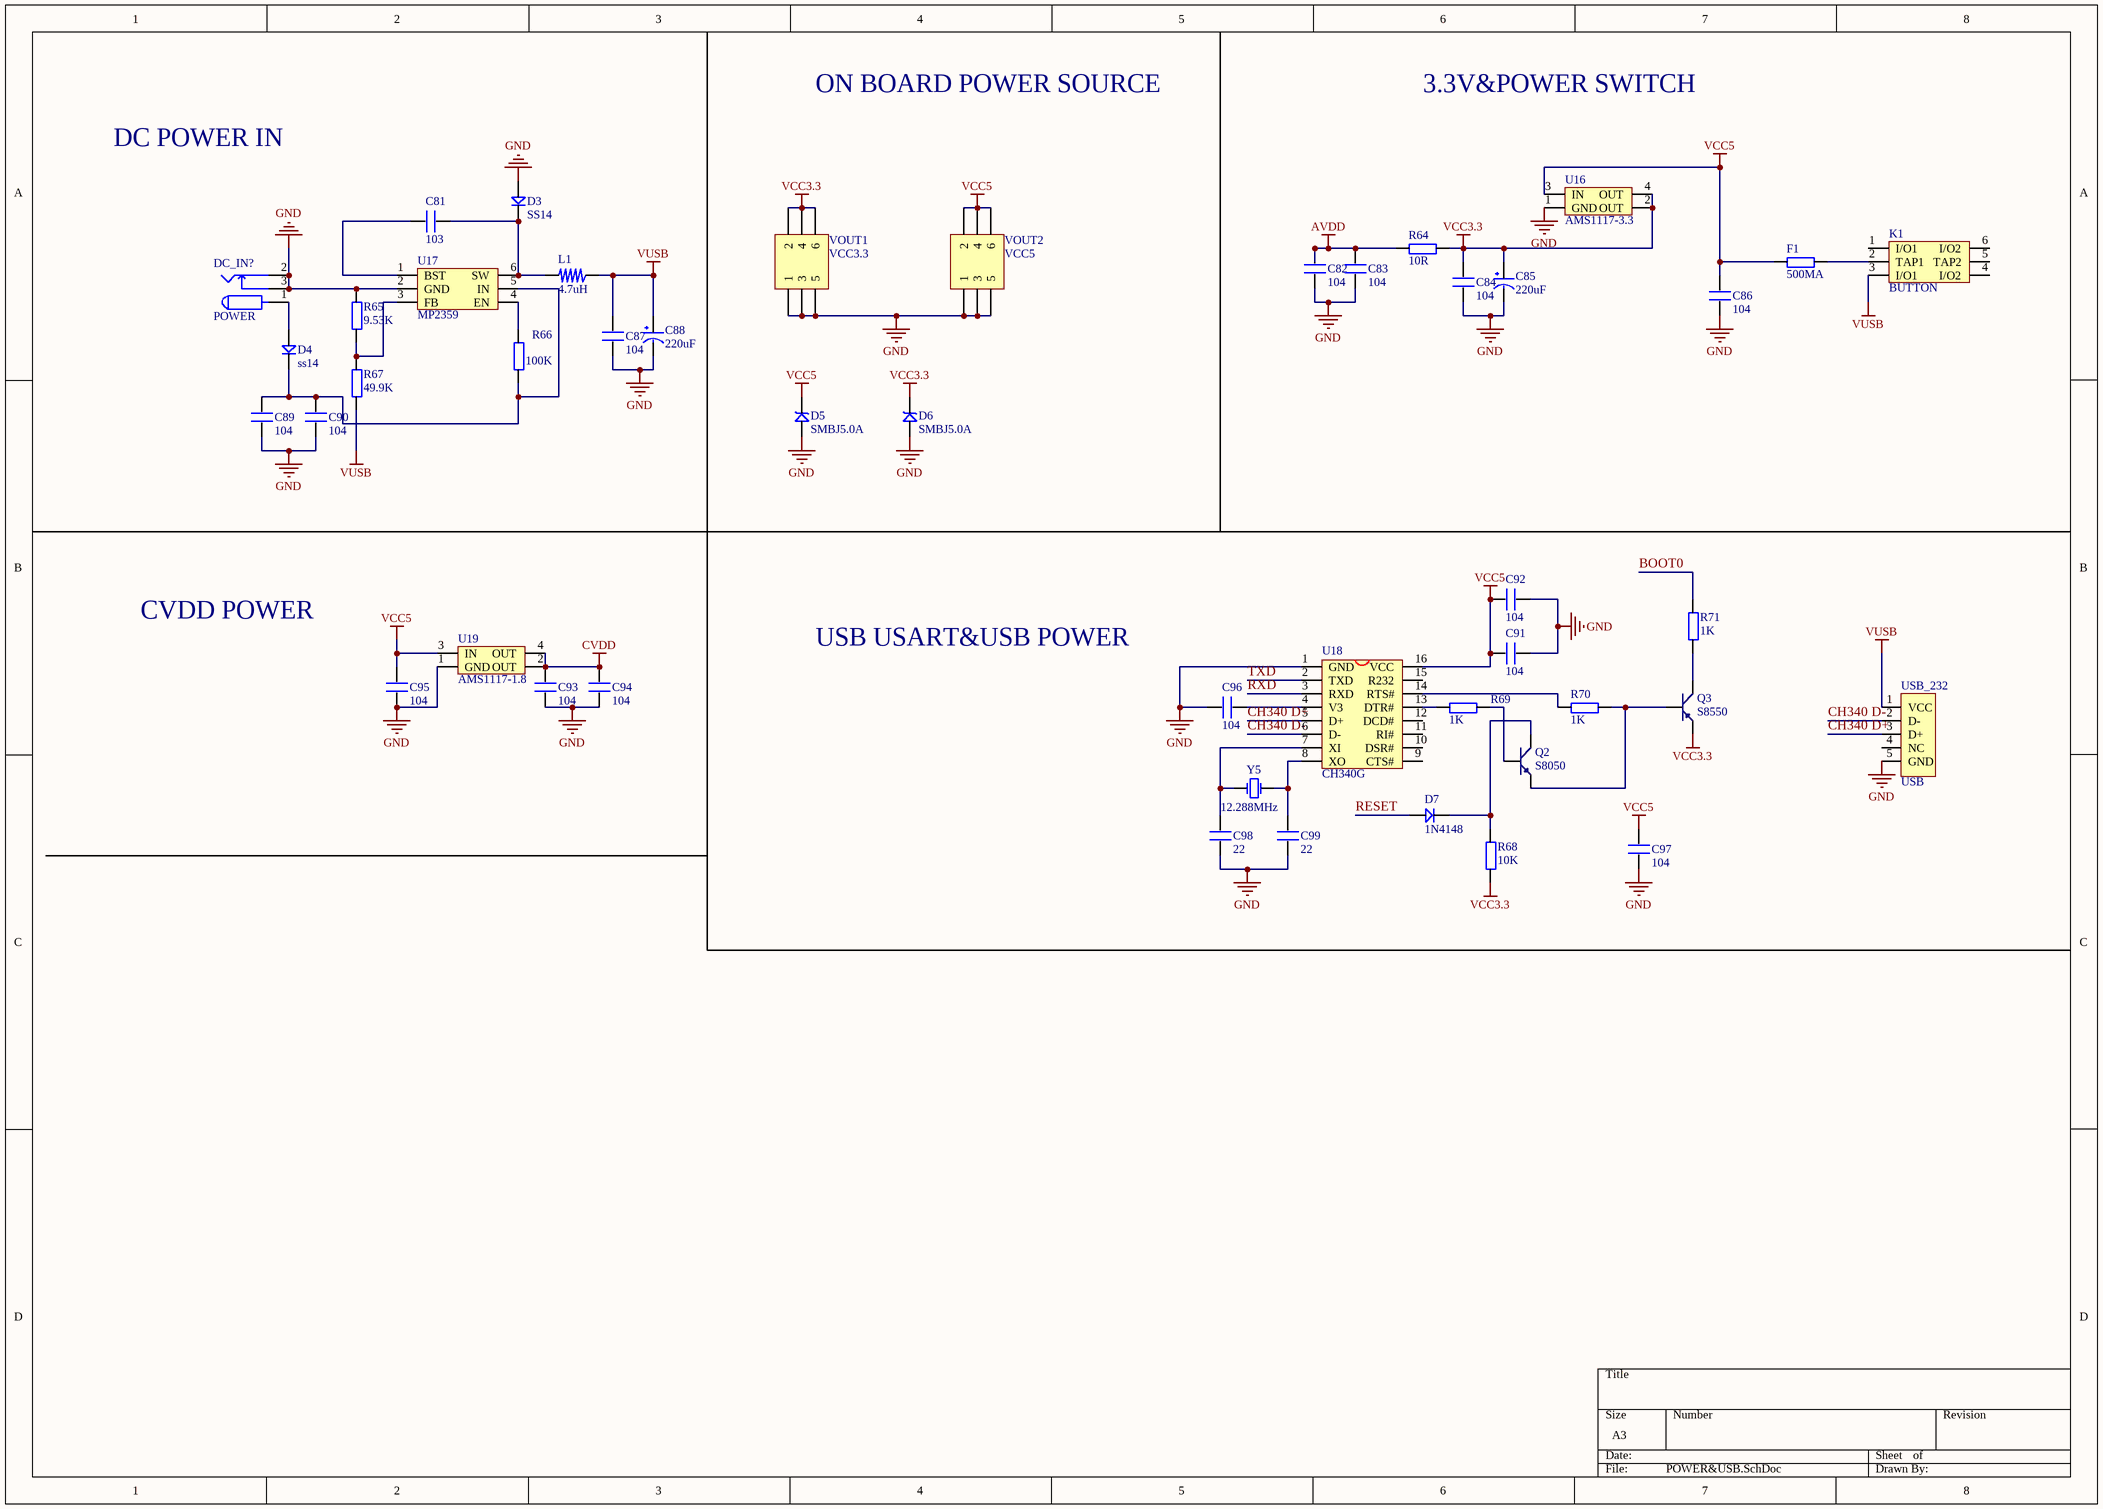
[diagram p3: POWER&USB.SchDoc]

### Parts
C81  103  [0603P]
C82  104  [0603P]
C83  104  [0603P]
C84  104  [0603P]
C85  220uF  [CC6.56.5]
C86  104  [0603P]
C87  104  [0603P]
C88  220uF  [CC6.56.5]
C89  104  [0603P]
C90  104  [0603P]
C91  104  [0603P]
C92  104  [0603P]
C93  104  [0603P]
C94  104  [0603P]
C95  104  [0603P]
C96  104  [0603P]
C97  104  [0603P]
C98  22  [0603P]
C99  22  [0603P]
D3  SS14  [DIODE_SOP]
D4  ss14  [DIODE_SOP]
D5  SMBJ5.0A  [SMBJ]
D6  SMBJ5.0A  [SMBJ]
D7  1N4148  [DIODE_SOP]
DC_IN  POWER  [DC10B]
F1  500MA  [0805]
K1  BUTTON  [BTN8.5*8.5]
L1  4.7uH  [L_SOP74]
Q2  S8050  [SOT-23R]
Q3  S8550  [SOT-23R]
R64  10R  [0603P]
R65  9.53K  [0603P]
R66  100K  [0603P]
R67  49.9K  [0603P]
R68  10K  [0603P]
R69  1K  [0603P]
R70  1K  [0603P]
R71  1K  [0603P]
U16  AMS1117-3.3  [AMS1117]
U17  MP2359  [SOT-23-6]
U18  CH340G  [SOP16M]
U19  AMS1117-1.8  [AMS1117]
USB_232  USB  [USB/SM0.8-6H5]
VOUT1  VCC3.3  [HDR2X3]
VOUT2  VCC5  [HDR2X3]
Y5  12.288MHz  [XTAL_US]

### Nets
AVDD: C82.2 C83.2 R64.1
CVDD: C93.2 C94.2 U19.2(OUT) U19.4(OUT)
GND: C82.1 C83.1 C84.1 C85.2(GND) C86.1 C87.1 C88.2(GND) C89.1 C90.1 C91.2 C92.2 C93.1 C94.1 C95.1 C96.1 C97.1 C98.1 C99.1 D3.1 D5.1 D6.1 DC_IN.2 DC_IN.3 R65.2 U16.1(GND) U17.2(GND) U18.1(GND) U19.1(GND) USB_232.5(GND) VOUT1.1 VOUT1.3 VOUT1.5 VOUT2.1 VOUT2.3 VOUT2.5
VCC3.3: C84.2 C85.1(VCC) D6.2 Q3.1(E) R64.2 R68.1 U16.2(OUT) U16.4(OUT) VOUT1.2 VOUT1.4 VOUT1.6
VCC5: C86.2 C91.1 C92.1 C95.2 C97.2 D5.2 F1.1 U16.3(IN) U18.16(VCC) U19.3(IN) VOUT2.2 VOUT2.4 VOUT2.6
VUSB: C87.2 C88.1(VCC) K1.3(I/O1) L1.1 R67.1 USB_232.1(VCC)
BOOT0: R71.2
CH340 D+: U18.5(D+) USB_232.3(D+)
CH340 D-: U18.6(D-) USB_232.2(D-)
RESET: D7.1
RXD: U18.3(RXD)
TXD: U18.2(TXD)
NetC81_1: C81.1 U17.1(BST)
NetC81_2: C81.2 D3.2 L1.2 U17.6(SW)
NetC89_2: C89.2 C90.2 D4.2 R66.1 U17.5(IN)
NetC96_2: C96.2 U18.4(V3)
NetC98_2: C98.2 U18.7(XI) Y5.1(OSC1)
NetC99_2: C99.2 U18.8(XO) Y5.2(OSC2)
NetD4_1: D4.1 DC_IN.1
NetD7_2: D7.2 Q2.3(C) R68.2
NetF1_2: F1.2 K1.2(TAP1)
NetQ2_1: Q2.1(E) Q3.2(B) R70.2
NetQ2_2: Q2.2(B) R69.2
NetQ3_3: Q3.3(C) R71.1
NetR65_1: R65.1 R67.2 U17.3(FB)
NetR66_2: R66.2 U17.4(EN)
NetR69_1: R69.1 U18.13(DTR#)
NetR70_1: R70.1 U18.14(RTS#)

Not connected (* = marked no-connect by the designer): K1 1(I/O1) 4(I/O2) 5(TAP2) 6(I/O2); U18 9(CTS#) 10(DSR#) 11(RI#) 12(DCD#) 15(R232); USB_232 4(NC)

### Notes on the sheet
- ON BOARD POWER SOURCE
- 3.3V&POWER SWITCH
- DC POWER IN
- CVDD POWER
- USB USART&USB POWER

### Library data of the parts
C81-C84 C86 C87 C89-C99 = C
C85 C88 = CAP
D3 D4 D7 = D
D5 D6 = SMBJ: TVS
DC_IN = POW
F1 R64-R71 = R
L1 = L_SOP
Q2 = NPN: 8050/BCW846/BCW847
Q3 = PNP: 8550/BCW68
U16 U19 = AMS1117
U17 = MP2359: DC DC Step Down IC
U18 = CH340G: USB2UART
USB_232 = USB5
VOUT1 VOUT2 = Header 3X2: Header, 3-Pin, Dual row; LatestRevisionDate: 17-Jul-2002; LatestRevisionNote: Re-released for DXP Platform.; Publisher: Altium Limited
Y5 = XTAL_2: Crystal Oscillator; Published: 8-Jun-2000; LatestRevisionDate: 17-Jul-2002; LatestRevisionNote: Re-released for DXP Platform.; Publisher: Altium Limited

## Nets that join several sheets
AVDD: AUDIO (7 pins), POWER&USB (C82.2 C83.2 R64.1)
CVDD: AUDIO (8 pins), POWER&USB (C93.2 C94.2 U19.2 U19.4)
GND: AUDIO (58 pins), DEVICE (57 pins), ZD-STM32 (56 pins), POWER&USB (35 pins)
VCC3.3: AUDIO (R14.2 R15.2 R16.2 R18.2), DEVICE (34 pins), ZD-STM32 (18 pins), POWER&USB (11 pins)
VCC5: AUDIO (R3.2 R7.2), DEVICE (5 pins), ZD-STM32 (2.4/2.8LCD.28 C42.2), POWER&USB (13 pins)
VUSB: DEVICE (USB.1), POWER&USB (6 pins)
3D INT: DEVICE (R57.1 U11.8 U13.2), ZD-STM32 (P4.38 U6.49)
ASEL A: AUDIO (R14.1 U2.10), ZD-STM32 (P5.15 U6.123)
ASEL B: AUDIO (R15.1 U2.9), ZD-STM32 (P5.3 U6.137)
BEEP: DEVICE (R58.2), ZD-STM32 (P5.2 U6.139)
BOOT0: ZD-STM32 (R40.1 U6.138), POWER&USB (R71.2)
F CS: DEVICE (U9.1), ZD-STM32 (P5.54 U6.73)
FIFO OE: DEVICE (P8.7), ZD-STM32 (P5.8 U6.132)
FIFO RCLK: DEVICE (P8.16), ZD-STM32 (JTAG.3 P5.6 R34.2 U6.134)
FIFO RRST: DEVICE (P8.5), ZD-STM32 (P5.9 U6.129)
FIFO WEN: DEVICE (P8.18), ZD-STM32 (P5.7 U6.133)
FIFO WRST: DEVICE (P8.3), ZD-STM32 (P5.16 U6.122)
IIC SCL: AUDIO (U4.9), DEVICE (R61.1 U11.14 U15.6), ZD-STM32 (P4.54 U6.69)
IIC SDA: AUDIO (U4.10), DEVICE (U11.13), ZD-STM32 (P4.53 U6.70)
JOY CLK: DEVICE (JOY_PAD.2 P11_SDIO.3), ZD-STM32 (P5.23 U6.113)
JOY DAT: DEVICE (JOY_PAD.4 P11_SDIO.1), ZD-STM32 (P5.32 U6.99)
JOY LAT: DEVICE (JOY_PAD.3 P11_SDIO.2), ZD-STM32 (P5.33 U6.98)
KEY0: DEVICE (KEY0.2), ZD-STM32 (P4.6 U6.3)
KEY1: DEVICE (KEY1.2), ZD-STM32 (P4.3 U6.2)
KEY2: DEVICE (KEY2.2), ZD-STM32 (P4.4 U6.1)
LED0: DEVICE (DS0.2), ZD-STM32 (P5.5 U6.135)
LED1: DEVICE (DS1.2), ZD-STM32 (P4.5 U6.4)
NRF CE: DEVICE (P12_SDSPI&NET.2 U7.3), ZD-STM32 (P5.38 U6.91)
NRF CS: DEVICE (U7.4), ZD-STM32 (P5.37 U6.92)
NRF IRQ: DEVICE (P12_SDSPI&NET.7 U7.8), ZD-STM32 (P5.36 U6.93)
OV D0: DEVICE (P8.8), ZD-STM32 (P4.19 U6.26)
OV D1: DEVICE (P8.9), ZD-STM32 (P4.22 U6.27)
OV D2: DEVICE (P8.10), ZD-STM32 (P4.21 U6.28)
OV D3: DEVICE (P8.11), ZD-STM32 (P4.24 U6.29)
OV D4: DEVICE (P8.12), ZD-STM32 (P4.31 U6.44)
OV D5: DEVICE (P8.13), ZD-STM32 (P4.34 U6.45)
OV D6: DEVICE (P8.14), ZD-STM32 (P5.35 U6.96)
OV D7: DEVICE (P8.15), ZD-STM32 (P5.34 U6.97)
OV SCL: DEVICE (P8.4), ZD-STM32 (P5.19 U6.117)
OV SDA: DEVICE (P8.6), ZD-STM32 (P5.10 U6.128)
OV VSYNC: DEVICE (P8.17), ZD-STM32 (P5.31 U6.100)
PA0: DEVICE (KEY_UP.2), ZD-STM32 (P4.23 U6.34)
PA1: DEVICE (P14.2), ZD-STM32 (P4.26 U6.35)
PA2: DEVICE (P9.3), ZD-STM32 (P4.25 U6.36)
PA3: DEVICE (P9.4), ZD-STM32 (P4.28 U6.37)
PA4: DEVICE (P14.3), ZD-STM32 (P4.27 U6.40)
PA5: AUDIO (U3.28), ZD-STM32 (P4.30 U6.41)
PA6: AUDIO (U3.30), ZD-STM32 (P4.29 U6.42)
PA7: AUDIO (U3.29), ZD-STM32 (P4.32 U6.43)
PA11: DEVICE (P13.4), ZD-STM32 (P5.30 U6.103)
PA12: DEVICE (P13.3), ZD-STM32 (P5.29 U6.104)
PB6: AUDIO (R28.1), ZD-STM32 (P5.4 U6.136)
PB9: DEVICE (R63.1 U14.1), ZD-STM32 (P5.1 U6.140)
PB13: DEVICE (P12_SDSPI&NET.4 U7.5 U9.6), ZD-STM32 (P5.53 U6.74)
PB14: DEVICE (P12_SDSPI&NET.3 U7.7 U9.2), ZD-STM32 (P5.52 U6.75)
PB15: DEVICE (P12_SDSPI&NET.5 U7.6 U9.5), ZD-STM32 (P5.51 U6.76)
PC10: DEVICE (P11_SDIO.6 PS/2.1), ZD-STM32 (P5.25 U6.111)
PC11: DEVICE (P11_SDIO.5 PS/2.5), ZD-STM32 (P5.24 U6.112)
PC13: AUDIO (U3.8), ZD-STM32 (P4.7 U6.7)
PD2: DEVICE (P11_SDIO.4 P12_SDSPI&NET.6), ZD-STM32 (P5.20 U6.116)
PE6: AUDIO (U3.3), ZD-STM32 (P4.8 U6.5)
PG9: DEVICE (U10.2 U10.3), ZD-STM32 (P5.14 U6.124)
RESET: ZD-STM32 (6 pins), POWER&USB (D7.1)
RXD: ZD-STM32 (P6.4), POWER&USB (U18.3)
TXD: ZD-STM32 (P6.2), POWER&USB (U18.2)